# Altium schematic sheet link.SchDoc
size A3
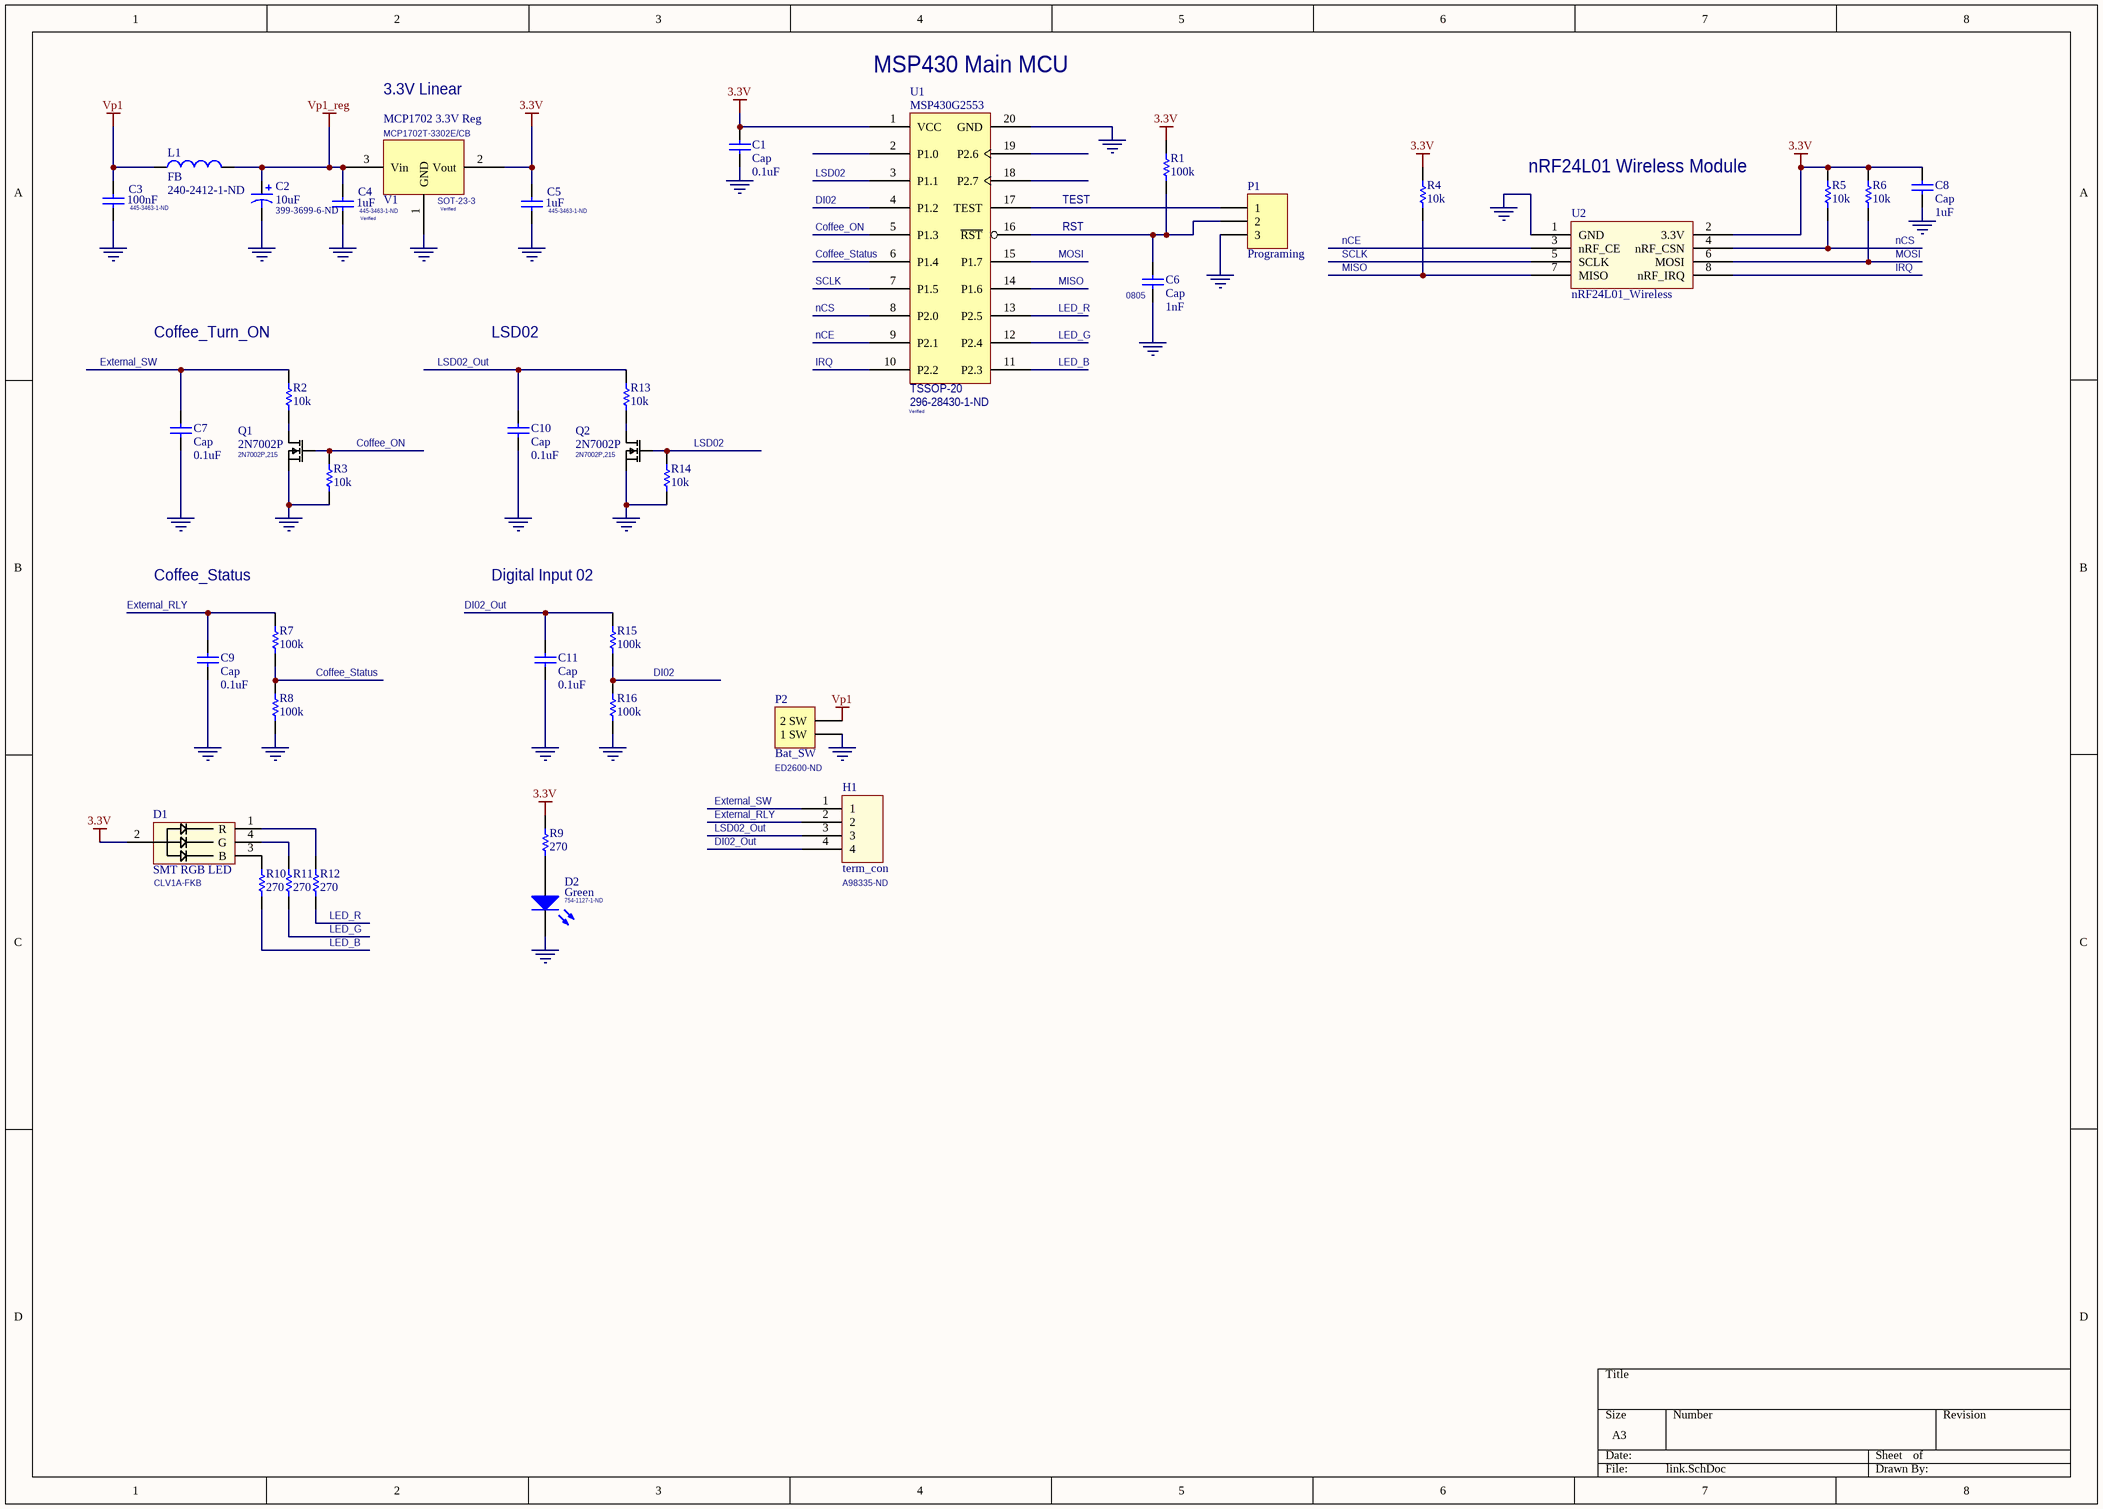
[diagram p0: link.SchDoc]

## Parts
C1  Cap  value 0.1uF  [C0805]
C2  value 10uF  [1206_C]  (hidden comment: Cap Pol1)
C3  value 100nF  [C0805]  (hidden comment: Cap)
C4  value 1uF  [C0805]  (hidden comment: Cap)
C5  value 1uF  [C0805]  (hidden comment: Cap)
C6  Cap  value 1nF  [C0805]
C7  Cap  value 0.1uF  [C0805]
C8  Cap  value 1uF  [C0805]
C9  Cap  value 0.1uF  [C0805]
C10  Cap  value 0.1uF  [C0805]
C11  Cap  value 0.1uF  [C0805]
D1  SMT RGB LED  [CLV1A-FKB_RGB]
D2  LED3  [6-0805_L]  (value not drawn)
H1  term_con  [A98335-ND]
L1  FB  value 240-2412-1-ND  [1206_IMP]
P1  Programing  [HDR1X3]
P2  Bat_SW  [5mm_2TERM]
Q1  2N7002P  [SOT-23_M]
Q2  2N7002P  [SOT-23_M]
R1  value 100k  [6-0805_L]  (hidden comment: Res1)
R2  value 10k  [6-0805_L]  (hidden comment: Res1)
R3  value 10k  [6-0805_L]  (hidden comment: Res1)
R4  value 10k  [6-0805_L]  (hidden comment: Res1)
R5  value 10k  [6-0805_L]  (hidden comment: Res1)
R6  value 10k  [6-0805_L]  (hidden comment: Res1)
R7  value 100k  [6-0805_L]  (hidden comment: Res1)
R8  value 100k  [6-0805_L]  (hidden comment: Res1)
R9  value 270  [6-0805_L]  (hidden comment: Res1)
R10  value 270  [6-0805_L]  (hidden comment: Res1)
R11  value 270  [6-0805_L]  (hidden comment: Res1)
R12  value 270  [6-0805_L]  (hidden comment: Res1)
R13  value 10k  [6-0805_L]  (hidden comment: Res1)
R14  value 10k  [6-0805_L]  (hidden comment: Res1)
R15  value 100k  [6-0805_L]  (hidden comment: Res1)
R16  value 100k  [6-0805_L]  (hidden comment: Res1)
U1  MSP430G2553  PCK: TSSOP-20  PART#: 296-28430-1-ND  [TSOP65P640-20AM]
U2  nRF24L01_Wireless  [NRF24L01]
V1  MCP1702 3.3V Reg  [SOT-23B_M]

## Nets
3.3V: C1.2 C5.2 C8.2 D1.2(V+) R1.1 R4.2 R5.2 R6.2 R9.1 U1.1(VCC) U2.2(3.3V) V1.2(Vout)
GND: C1.1 C2.2 C3.1 C4.1 C5.1 C6.1 C7.1 C8.1 C9.1 C10.1 C11.1 D2.2(K) P1.3 P2.1(1_SW) Q1.2(S) Q2.2(S) R3.2 R8.2 R14.2 R16.2 U1.20(GND) U2.1(GND) V1.1(GND)
Vp1: C3.2 L1.1 P2.2(2_SW)
Vp1_reg: C2.1 C4.2 L1.2 V1.3(Vin)
Coffee_ON: Q1.1(G) R3.1 U1.5(P1.3)
Coffee_Status: R7.2 R8.1 U1.6(P1.4)
DI02: R15.2 R16.1 U1.4(P1.2)
DI02_Out: C11.2 H1.4 R15.1
External_RLY: C9.2 H1.2 R7.1
External_SW: C7.2 H1.1 R2.1
IRQ: U1.10(P2.2) U2.8(nRF_IRQ)
LED_B: R10.2 U1.11(P2.3)
LED_G: R11.2 U1.12(P2.4)
LED_R: R12.2 U1.13(P2.5)
LSD02: Q2.1(G) R14.1 U1.3(P1.1)
LSD02_Out: C10.2 H1.3 R13.1
MISO: R4.1 U1.14(P1.6) U2.7(MISO)
MOSI: R6.1 U1.15(P1.7) U2.6(MOSI)
nCE: U1.9(P2.1) U2.3(nRF_CE)
nCS: R5.1 U1.8(P2.0) U2.4(nRF_CSN)
RST: C6.2 P1.2 R1.2 U1.16(~{RST})
SCLK: U1.7(P1.5) U2.5(SCLK)
TEST: P1.1 U1.17(TEST)
NetD1_1: D1.1(R) R12.1
NetD1_3: D1.3(B) R10.1
NetD1_4: D1.4(G) R11.1
NetD2_1: D2.1(A) R9.2
NetQ1_3: Q1.3(D) R2.2
NetQ2_3: Q2.3(D) R13.2

Not connected (* = marked no-connect by the designer): U1 2(P1.0) 18(P2.7) 19(P2.6)

## Notes on the sheet
- 3.3V Linear
- (near U1) MSP430 Main MCU
- (near V1) MCP1702T-3302E/CB
- nRF24L01 Wireless Module
- Verified
- (near V1) SOT-23-3
- (near V1) Verified
- (near C6) 0805
- (near R2) Coffee_Turn_ON
- LSD02
- (near U1) Verified
- (near R7) Coffee_Status
- (near R15) Digital Input 02
- (in symbol 2N7002P) 2N7002P,215
- (in symbol A98335ND_v1) A98335-ND
- (in symbol Cap) 445-3463-1-ND
- (in symbol Cap Pol1) 399-3699-6-ND
- (in symbol LED3) Green; 754-1127-1-ND
- (in symbol MHDR1X2) ED2600-ND
- (in symbol RGB_LED_SMT) CLV1A-FKB

## Library data of the parts
C1 C3-C11 = Cap: Capacitor
  C1 C6-C11: Published: 8-Jun-2000; LatestRevisionDate: 17-Jul-2002; LatestRevisionNote: Re-released for DXP Platform.; PackageReference: RAD-0.3; Publisher: Altium Limited; PackageDescription: Radial Cap, Thru-Hole; 2 Leads; 0.3 in Pin Spacing
C2 = Cap Pol1: Polarized Capacitor (Radial)
D1 = RGB_LED_SMT
D2 = LED3: Typical BLUE SiC LED
H1 = A98335ND_v1
L1 = Inductor
P1 = Header 3: Header, 3-Pin; LatestRevisionDate: 17-Jul-2002; LatestRevisionNote: Re-released for DXP Platform.; Publisher: Altium Limited
P2 = MHDR1X2: Header, 2-Pin
R1-R16 = Res1: Resistor; Published: 8-Jun-2000; LatestRevisionDate: 17-Jul-2002; LatestRevisionNote: Re-released for DXP Platform.; PackageReference: AXIAL-0.3; Publisher: Altium Limited; PackageDescription: Axial Device, Thru-Hole; 2 Leads; 0.3 in Pin Spacing
V1 = MCP1700: MCP1700 3.3V REG